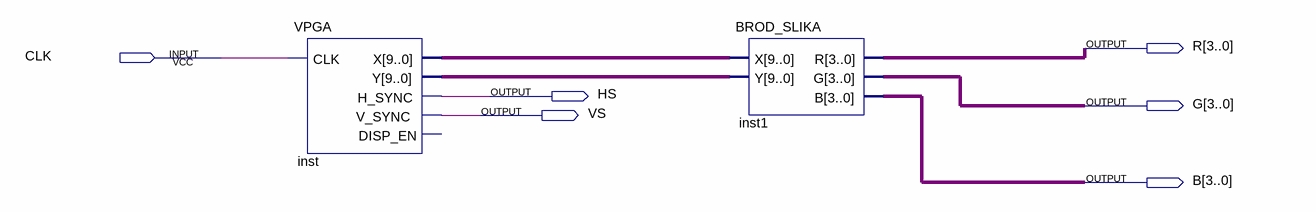
[diagram p0: schematic sheet]
// Quartus schematic BROD_SLIKA.bdf as structural Verilog: 2 symbols, 6 pins
module BROD_SLIKA (
  input  CLK,
  output [3:0] R,
  output HS,
  output [3:0] G,
  output VS,
  output [3:0] B
);

  wire [9:0] inst_x, inst_y;

  VPGA inst (.CLK(CLK), .X(inst_x), .Y(inst_y), .H_SYNC(HS), .V_SYNC(VS));  // open: DISP_EN
  BROD_SLIKA inst1 (.X(inst_x), .Y(inst_y), .R(R), .G(G), .B(B));
endmodule
